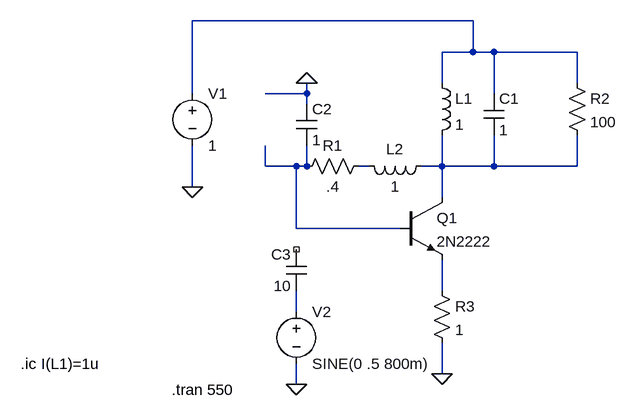
[diagram p0: schematic Draft2.asc]
Draft2.asc, the LTspice schematic file:
Version 4
SHEET 1 880 680
WIRE 288 -80 -144 -80
WIRE 288 -32 288 -80
WIRE 288 -32 240 -32
WIRE 320 -32 288 -32
WIRE 448 -32 320 -32
WIRE 240 16 240 -32
WIRE 448 16 448 -32
WIRE -144 32 -144 -80
WIRE 32 32 32 16
WIRE 32 32 -32 32
WIRE 320 32 320 -32
WIRE 32 48 32 32
WIRE -32 144 -32 112
WIRE 16 144 -32 144
WIRE 32 144 32 112
WIRE 32 144 16 144
WIRE 128 144 112 144
WIRE 240 144 240 96
WIRE 240 144 208 144
WIRE 320 144 320 96
WIRE 320 144 240 144
WIRE 448 144 448 96
WIRE 448 144 320 144
WIRE -144 176 -144 112
WIRE 240 192 240 144
WIRE 16 240 16 144
WIRE 176 240 16 240
WIRE 240 336 240 288
WIRE 16 368 16 336
WIRE 240 464 240 416
WIRE 16 480 16 448
FLAG 240 464 0
FLAG -144 176 0
FLAG 32 16 0
FLAG 16 480 0
SYMBOL npn 176 192 R0
SYMATTR InstName Q1
SYMATTR Value 2N2222
SYMBOL cap 304 32 R0
SYMATTR InstName C1
SYMATTR Value 1
SYMBOL ind 224 0 R0
SYMATTR InstName L1
SYMATTR Value 1
SYMBOL voltage -144 16 R0
WINDOW 123 0 0 Left 0
WINDOW 39 0 0 Left 0
SYMATTR InstName V1
SYMATTR Value 1
SYMBOL cap 16 48 R0
SYMATTR InstName C2
SYMATTR Value 1
SYMBOL res 128 128 R90
WINDOW 0 0 56 VBottom 2
WINDOW 3 32 56 VTop 2
SYMATTR InstName R1
SYMATTR Value .4
SYMBOL res 432 0 R0
SYMATTR InstName R2
SYMATTR Value 100
SYMBOL ind 224 128 R90
WINDOW 0 5 56 VBottom 2
WINDOW 3 32 56 VTop 2
SYMATTR InstName L2
SYMATTR Value 1
SYMBOL cap 32 336 R180
WINDOW 0 24 56 Left 2
WINDOW 3 24 8 Left 2
SYMATTR InstName C3
SYMATTR Value 10
SYMBOL voltage 16 352 R0
WINDOW 123 0 0 Left 0
WINDOW 39 0 0 Left 0
SYMATTR InstName V2
SYMATTR Value SINE(0 .5 800m)
SYMBOL res 224 320 R0
SYMATTR InstName R3
SYMATTR Value 1
TEXT -176 488 Left 2 !.tran 550
TEXT -408 448 Left 2 !.ic I(L1)=1u

The netlist it stands for:
* Draft2.asc
Q1 N004 N002 N005 0 2N2222
C1 N001 N004 1
L1 N001 N004 1
V1 N001 0 1
C2 0 N002 1
R1 N003 N002 .4
R2 N001 N004 100
L2 N004 N003 1
C3 N006 NC_01 10
V2 N006 0 SINE(0 .5 800m)
R3 N005 0 1
.model NPN NPN
.model PNP PNP
.lib standard.bjt
.tran 550
.ic I(L1)=1u
.backanno
.end